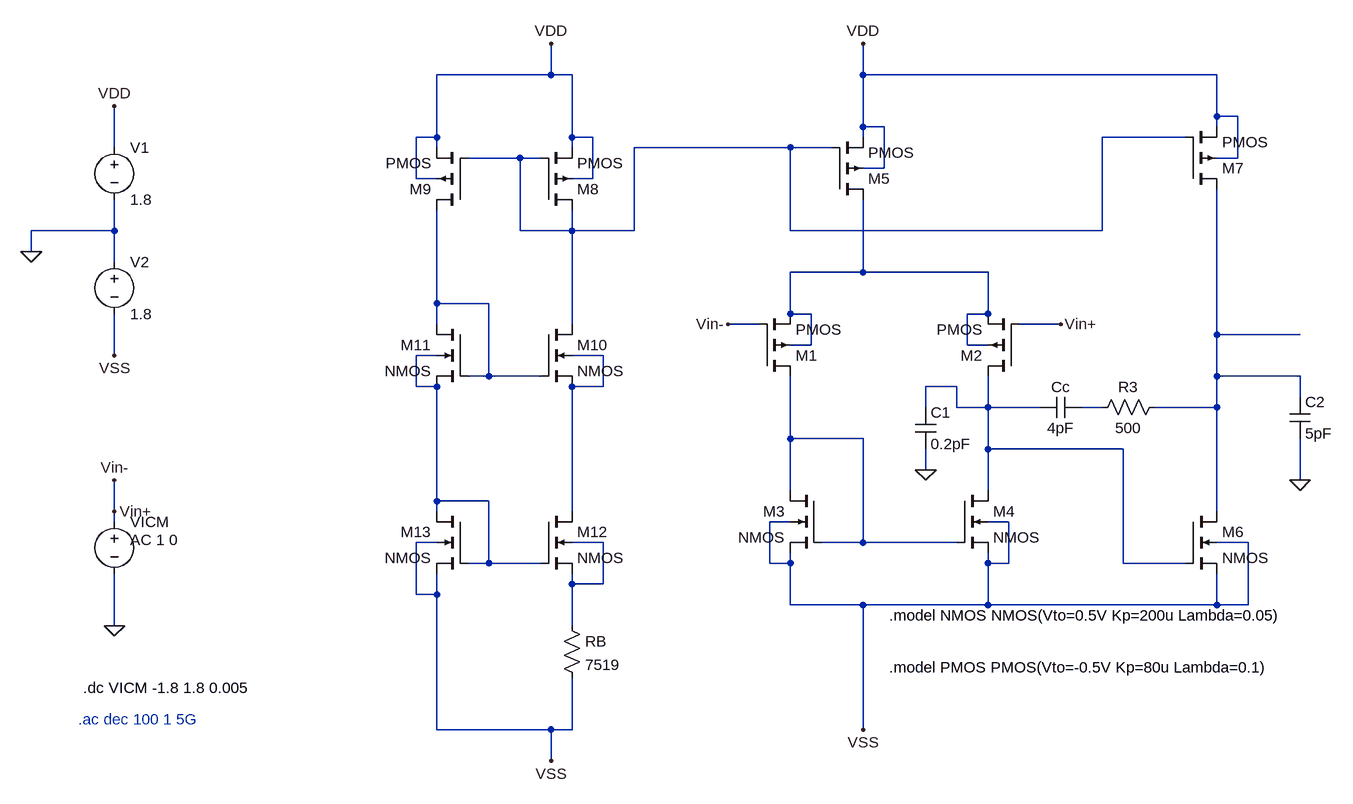
[diagram p0: schematic Le_project2.asc]
Le_project2.asc, the LTspice schematic file:
Version 4
SHEET 1 1488 844
WIRE -48 -304 -48 -352
WIRE -48 -304 -224 -304
WIRE -16 -304 -48 -304
WIRE 432 -304 432 -352
WIRE 976 -304 432 -304
WIRE 976 -240 976 -304
WIRE 1008 -240 976 -240
WIRE 432 -224 432 -304
WIRE 464 -224 432 -224
WIRE 976 -224 976 -240
WIRE -224 -208 -224 -304
WIRE -224 -208 -256 -208
WIRE -16 -208 -16 -304
WIRE 16 -208 -16 -208
WIRE 432 -208 432 -224
WIRE 928 -208 800 -208
WIRE -720 -192 -720 -256
WIRE -224 -192 -224 -208
WIRE -16 -192 -16 -208
WIRE 320 -192 80 -192
WIRE 384 -192 320 -192
WIRE -96 -176 -176 -176
WIRE -64 -176 -96 -176
WIRE 1008 -176 1008 -240
WIRE 1008 -176 976 -176
WIRE 464 -160 464 -224
WIRE 464 -160 432 -160
WIRE -256 -144 -256 -208
WIRE -224 -144 -256 -144
WIRE 16 -144 16 -208
WIRE 16 -144 -16 -144
WIRE -720 -64 -720 -112
WIRE -720 -64 -848 -64
WIRE -96 -64 -96 -176
WIRE -16 -64 -16 -96
WIRE -16 -64 -96 -64
WIRE 80 -64 80 -192
WIRE 80 -64 -16 -64
WIRE 320 -64 320 -192
WIRE 800 -64 800 -208
WIRE 800 -64 320 -64
WIRE -848 -32 -848 -64
WIRE -720 -16 -720 -64
WIRE 432 0 432 -112
WIRE 432 0 320 0
WIRE 624 0 432 0
WIRE -224 48 -224 -96
WIRE -144 48 -224 48
WIRE 320 64 320 0
WIRE 352 64 320 64
WIRE 624 64 624 0
WIRE 624 64 592 64
WIRE -224 80 -224 48
WIRE -16 80 -16 -64
WIRE 272 80 224 80
WIRE 736 80 672 80
WIRE 976 96 976 -128
WIRE 1104 96 976 96
WIRE 352 112 352 64
WIRE 352 112 320 112
WIRE 592 112 592 64
WIRE 624 112 592 112
WIRE -720 128 -720 64
WIRE -224 128 -256 128
WIRE 32 128 -16 128
WIRE -144 160 -144 48
WIRE -144 160 -176 160
WIRE -64 160 -144 160
WIRE 976 160 976 96
WIRE 1104 160 976 160
WIRE -256 176 -256 128
WIRE -224 176 -256 176
WIRE 32 176 32 128
WIRE 32 176 -16 176
WIRE 576 176 528 176
WIRE 1104 192 1104 160
WIRE 528 208 528 176
WIRE 576 208 576 176
WIRE 624 208 624 160
WIRE 624 208 576 208
WIRE 704 208 624 208
WIRE 800 208 768 208
WIRE 976 208 976 160
WIRE 976 208 880 208
WIRE 320 256 320 160
WIRE 432 256 320 256
WIRE 624 272 624 208
WIRE 832 272 624 272
WIRE 528 304 528 272
WIRE 1104 320 1104 256
WIRE 320 336 320 256
WIRE 624 336 624 272
WIRE -224 352 -224 176
WIRE -144 352 -224 352
WIRE -720 368 -720 320
WIRE -224 368 -224 352
WIRE -16 368 -16 176
WIRE 976 368 976 208
WIRE -720 384 -720 368
WIRE 320 384 288 384
WIRE 656 384 624 384
WIRE -224 416 -256 416
WIRE 32 416 -16 416
WIRE 432 416 432 256
WIRE 432 416 368 416
WIRE 576 416 432 416
WIRE 1024 416 976 416
WIRE -144 448 -144 352
WIRE -144 448 -176 448
WIRE -64 448 -144 448
WIRE 288 448 288 384
WIRE 320 448 320 432
WIRE 320 448 288 448
WIRE 624 448 624 432
WIRE 656 448 656 384
WIRE 656 448 624 448
WIRE 832 448 832 272
WIRE 928 448 832 448
WIRE -16 480 -16 464
WIRE 32 480 32 416
WIRE 32 480 -16 480
WIRE -256 496 -256 416
WIRE -224 496 -224 464
WIRE -224 496 -256 496
WIRE 320 512 320 448
WIRE 432 512 320 512
WIRE 624 512 624 448
WIRE 624 512 432 512
WIRE 976 512 976 464
WIRE 976 512 624 512
WIRE 1024 512 1024 416
WIRE 1024 512 976 512
WIRE -720 544 -720 464
WIRE -16 544 -16 480
WIRE -224 704 -224 496
WIRE -48 704 -224 704
WIRE -16 704 -16 624
WIRE -16 704 -48 704
WIRE 432 704 432 512
WIRE -48 752 -48 704
FLAG 432 -352 VDD
FLAG 432 704 VSS
FLAG -48 752 VSS
FLAG -848 -32 0
FLAG -720 -256 VDD
FLAG -720 128 VSS
FLAG 736 80 Vin+
FLAG 1104 320 0
FLAG 528 304 0
FLAG 224 80 Vin-
FLAG -48 -352 VDD
FLAG -720 544 0
FLAG -720 368 Vin+
FLAG -720 320 Vin-
SYMBOL pmos4 272 160 M180
SYMATTR Value2 l=1u w=12.63u
SYMATTR InstName M1
SYMBOL pmos4 672 160 R180
SYMATTR Value2 l=1u w=12.63u
SYMATTR InstName M2
SYMBOL nmos4 368 336 M0
SYMATTR Value2 l=1u w=5u
SYMATTR InstName M3
SYMBOL nmos4 576 336 R0
SYMATTR Value2 l=1u w=5u
SYMATTR InstName M4
SYMBOL pmos4 384 -112 M180
SYMATTR Value2 l=1u w=11.04u
SYMATTR InstName M5
SYMBOL nmos4 928 368 R0
SYMATTR Value2 l=1u w=50.25u
SYMATTR InstName M6
SYMBOL pmos4 928 -128 M180
SYMATTR Value2 l=1u w=55.461u
SYMATTR InstName M7
SYMBOL pmos4 -64 -96 M180
SYMATTR Value2 l=1u w=5.52u
SYMATTR InstName M8
SYMBOL pmos4 -176 -96 R180
SYMATTR Value2 l=1u w=5.52u
SYMATTR InstName M9
SYMBOL nmos4 -64 80 R0
SYMATTR Value2 l=1u w=2.211u
SYMATTR InstName M10
SYMBOL nmos4 -176 80 M0
SYMATTR Value2 l=1u w=2.211u
SYMATTR InstName M11
SYMBOL nmos4 -64 368 R0
SYMATTR Value2 l=1u w=8.844u
SYMATTR InstName M12
SYMBOL nmos4 -176 368 M0
SYMATTR Value2 l=1u w=2.211u
SYMATTR InstName M13
SYMBOL res -32 528 R0
SYMATTR InstName RB
SYMATTR Value 7519
SYMBOL voltage -720 -208 R0
SYMATTR InstName V1
SYMATTR Value 1.8
SYMBOL voltage -720 -32 R0
SYMATTR InstName V2
SYMATTR Value 1.8
SYMBOL cap 768 192 R90
WINDOW 0 0 32 VBottom 2
WINDOW 3 32 32 VTop 2
SYMATTR InstName Cc
SYMATTR Value 4pF
SYMBOL cap 1088 192 R0
SYMATTR InstName C2
SYMATTR Value 5pF
SYMBOL cap 512 208 R0
SYMATTR InstName C1
SYMATTR Value 0.2pF
SYMBOL res 896 192 R90
WINDOW 0 0 56 VBottom 2
WINDOW 3 32 56 VTop 2
SYMATTR InstName R3
SYMATTR Value 500
SYMBOL voltage -720 368 R0
WINDOW 3 24 44 Left 2
WINDOW 123 24 44 Left 2
WINDOW 39 0 0 Left 0
SYMATTR Value ""
SYMATTR InstName VICM
SYMATTR Value2 AC 1 0
TEXT 472 608 Left 2 !.model PMOS PMOS(Vto=-0.5V Kp=80u Lambda=0.1)
TEXT 472 528 Left 2 !.model NMOS NMOS(Vto=0.5V Kp=200u Lambda=0.05)
TEXT -768 640 Left 2 !.dc VICM -1.8 1.8 0.005
TEXT -776 688 Left 2 ;.ac dec 100 1 5G

The netlist it stands for:
* Le_project2.asc
M1 N009 Vin- N002 N002 PMOS l=1u w=12.63u
M2 N007 Vin- N002 N002 PMOS l=1u w=12.63u
M3 N009 N009 VSS VSS NMOS l=1u w=5u
M4 N007 N009 VSS VSS NMOS l=1u w=5u
M5 N002 N001 VDD VDD PMOS l=1u w=11.04u
M6 N004 N007 VSS VSS NMOS l=1u w=50.25u
M7 N004 N001 VDD VDD PMOS l=1u w=55.461u
M8 N001 N001 VDD VDD PMOS l=1u w=5.52u
M9 N003 N001 VDD VDD PMOS l=1u w=5.52u
M10 N001 N003 N006 N006 NMOS l=1u w=2.211u
M11 N003 N003 N005 N005 NMOS l=1u w=2.211u
M12 N006 N005 N010 N010 NMOS l=1u w=8.844u
M13 N005 N005 VSS VSS NMOS l=1u w=2.211u
RB N010 VSS 7519
V1 VDD 0 1.8
V2 0 VSS 1.8
Cc N008 N007 4pF
C2 N004 0 5pF
C1 N007 0 0.2pF
R3 N004 N008 500
VICM Vin- 0 AC 1 0
.model NMOS NMOS
.model PMOS PMOS
.lib standard.mos
.model PMOS PMOS(Vto=-0.5V Kp=80u Lambda=0.1)
.model NMOS NMOS(Vto=0.5V Kp=200u Lambda=0.05)
.dc VICM -1.8 1.8 0.005
* .ac dec 100 1 5G
.backanno
.end